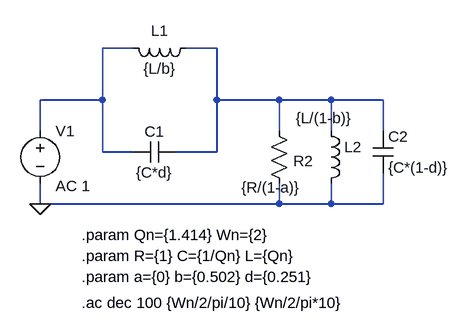
[diagram p0: schematic Ej2-a.asc]
Ej2-a.asc, the LTspice schematic file:
Version 4
SHEET 1 880 680
WIRE 0 96 -48 96
WIRE 128 96 80 96
WIRE -48 176 -48 96
WIRE -48 176 -144 176
WIRE 128 176 128 96
WIRE 224 176 128 176
WIRE 304 176 224 176
WIRE 384 176 304 176
WIRE -144 224 -144 176
WIRE 224 224 224 176
WIRE 304 224 304 176
WIRE 384 224 384 176
WIRE -48 256 -48 176
WIRE 0 256 -48 256
WIRE 128 256 128 176
WIRE 128 256 64 256
WIRE -144 336 -144 304
WIRE 224 336 224 304
WIRE 224 336 -144 336
WIRE 304 336 304 304
WIRE 304 336 224 336
WIRE 384 336 384 288
WIRE 384 336 304 336
FLAG -144 336 0
SYMBOL ind 96 80 R90
WINDOW 0 5 56 VBottom 2
WINDOW 3 32 56 VTop 2
SYMATTR InstName L1
SYMATTR Value {L/b}
SYMBOL cap 64 240 R90
WINDOW 0 0 32 VBottom 2
WINDOW 3 32 32 VTop 2
SYMATTR InstName C1
SYMATTR Value {C*d}
SYMBOL res 208 208 R0
WINDOW 0 38 62 Left 2
WINDOW 3 -42 103 Left 2
SYMATTR InstName R2
SYMATTR Value {R/(1-a)}
SYMBOL ind 288 208 R0
WINDOW 3 -38 -4 Left 2
SYMATTR Value {L/(1-b)}
SYMATTR InstName L2
SYMBOL cap 368 224 R0
SYMATTR InstName C2
SYMATTR Value {C*(1-d)}
SYMBOL voltage -144 208 R0
WINDOW 123 24 100 Left 2
WINDOW 39 0 0 Left 0
SYMATTR Value2 AC 1
SYMATTR InstName V1
SYMATTR Value ""
TEXT -80 384 Left 2 !.param Qn={1.414} Wn={2}
TEXT -80 416 Left 2 !.param R={1} C={1/Qn} L={Qn}
TEXT -80 448 Left 2 !.param a={0} b={0.502} d={0.251}
TEXT -80 488 Left 2 !.ac dec 100 {Wn/2/pi/10} {Wn/2/pi*10}

The netlist it stands for:
* Ej2-a.asc
L1 N002 N001 {L/b}
C1 N002 N001 {C*d}
R2 N002 0 {R/(1-a)}
L2 N002 0 {L/(1-b)}
C2 N002 0 {C*(1-d)}
V1 N001 0 AC 1
.param Qn={1.414} Wn={2}
.param R={1} C={1/Qn} L={Qn}
.param a={0} b={0.502} d={0.251}
.ac dec 100 {Wn/2/pi/10} {Wn/2/pi*10}
.backanno
.end